# Altium project FinalCooling.PrjPcb
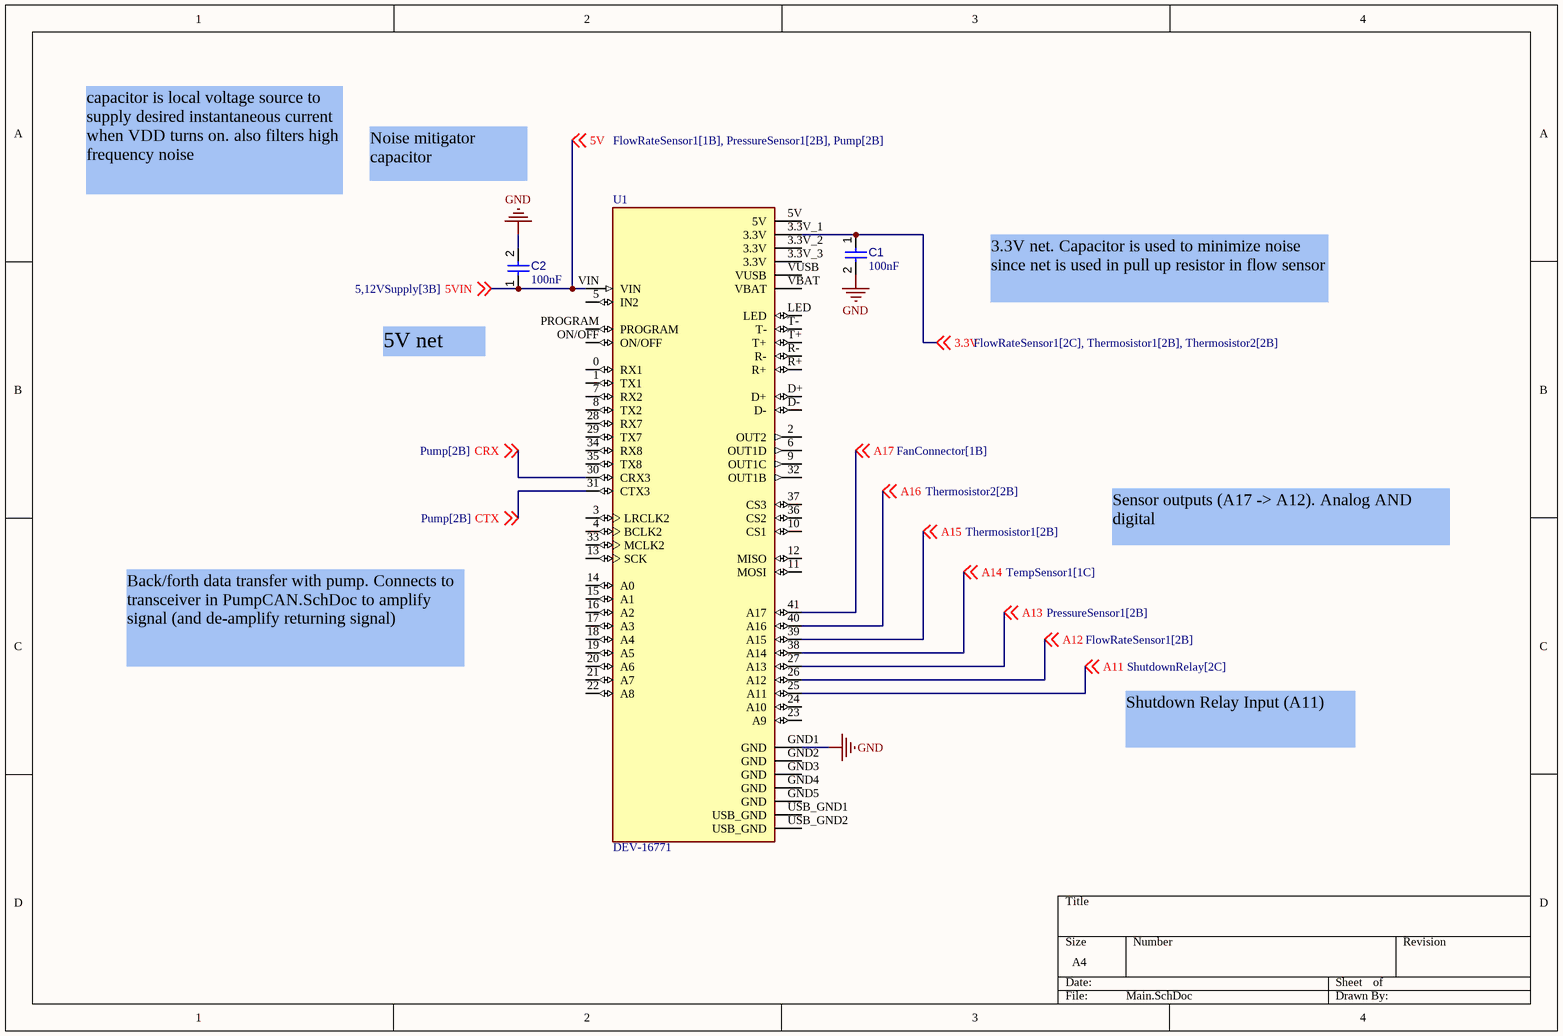
[diagram p0: Main.SchDoc]
10 sheets, 31 parts. Net scope: global (net labels, ports and power ports of the same name join across sheets).
Board file: PCB1.PcbDoc
Sheets:
  Main.SchDoc
  Thermosistor2.SchDoc
  FanConnector.SchDoc
  Pump.SchDoc
  TempSensor1.SchDoc
  Thermosistor1.SchDoc
  PressureSensor1.SchDoc
  FlowRateSensor1.SchDoc
  5,12VSupply.SchDoc
  16VPow.SchDoc

## Sheet Main.SchDoc
size A4; SheetNumber: 1; SheetTotal: 11

### Parts
C1  value 100nF  [CAPC1005X56X25LL10T15]  (hidden comment: Capacitor 0.1 uF +/- 5% 16 V 0402)
C2  value 100nF  [CAPC1005X56X25LL10T15]  (hidden comment: Capacitor 0.1 uF +/- 5% 16 V 0402)
U1  DEV-16771  [MODULE_DEV-16771]

### Nets
GND: C1.2 C2.2 U1.GND1(GND)
3.3V: C1.1 U1.3.3V_1(3.3V) ; off-sheet 3.3V
5V: C2.1 U1.VIN ; off-sheet 5V, off-sheet 5VIN  [also labelled 5VIN]
A11: U1.25(A11) ; off-sheet A11
A12: U1.26(A12) ; off-sheet A12
A13: U1.27(A13) ; off-sheet A13
A14: U1.38(A14) ; off-sheet A14
A15: U1.39(A15) ; off-sheet A15
A16: U1.40(A16) ; off-sheet A16
A17: U1.41(A17) ; off-sheet A17
CRX: U1.30(CRX3) ; off-sheet CRX
CTX: U1.31(CTX3) ; off-sheet CTX

Not connected (* = marked no-connect by the designer): U1 0(RX1) 1(TX1) 2(OUT2) 3(LRCLK2) 3.3V_2(3.3V) 3.3V_3(3.3V) 4(BCLK2) 5(IN2) 5V 6(OUT1D) 7(RX2) 8(TX2) 9(OUT1C) 10(CS1) 11(MOSI) 12(MISO) 13(SCK) 14(A0) 15(A1) 16(A2) 17(A3) 18(A4) 19(A5) 20(A6) 21(A7) 22(A8) 23(A9) 24(A10) 28(RX7) 29(TX7) 32(OUT1B) 33(MCLK2) 34(RX8) 35(TX8) 36(CS2) 37(CS3) D+ D- GND2(GND) GND3(GND) GND4(GND) GND5(GND) LED ON/OFF PROGRAM R+ R- T+ T- USB_GND1(USB_GND) USB_GND2(USB_GND) VBAT VUSB

### Notes on the sheet
- Noise mitigator capacitor
- capacitor is local voltage source to supply desired instantaneous current when VDD turns on. also filters high frequency noise
- 3.3V net. Capacitor is used to minimize noise since net is used in pull up resistor in flow sensor
- 5V net
- Sensor outputs (A17 -> A12). Analog AND digital
- Back/forth data transfer with pump. Connects to transceiver in PumpCAN.SchDoc to amplify signal (and de-amplify returning signal)
- Shutdown Relay Input (A11)

### Library data of the parts
C1 C2 = CMP-001-00001-6: Chip Capacitor, 0.1 uF, +/- 5%, 16 V, 0402 (1005 Metric); Capacitor Type: Ceramic; Voltage Rating: 16V; Max Operating Temperature: 125°C; Min Operating Temperature: -55°C; Case/Package: 0402; Mounting Technology: SM; Pins: 2; Tolerance: 5%; RoHS Compliant: True
U1 = CMP-031-00006-1: RT1062 Teensy 4.1 series ARM® Cortex®-M7 MPU Embedded Evaluation Board; MF: SparkFun Electronics; Case/Package: None; Source: DEV-16771.SchLib; SnapEDA_Link: https://www.snapeda.com/parts/DEV-16771/SparkFun+Electronics/view-part/?ref=snap; Component Type: Standard; Value: *; Design Item ID: DEV-16771; Check_prices: https://www.snapeda.com/parts/DEV-16771/SparkFun+Electronics/view-part/?ref=eda; MP: DEV-16771; Pins: 65

## Sheet Thermosistor2.SchDoc
size A4; SheetNumber: 3; SheetTotal: 11
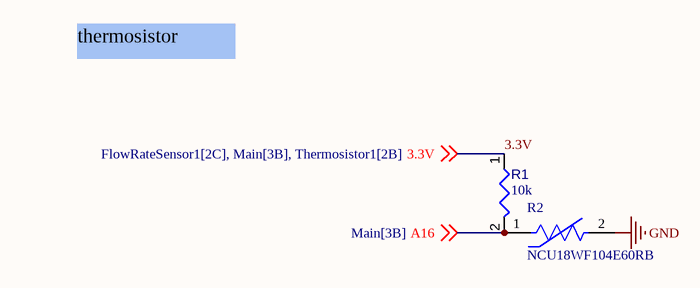
[diagram p1: Thermosistor2.SchDoc]

### Parts
R1  value 10k  [RESC0402(1005)_L]  (hidden comment: Resistor 10K  +/-1 % 0402 63 mW)
R2  NCU18WF104E60RB  [FP-NCU18-0_15-IPC_C]

### Nets
GND: R2.2
3.3V: R1.1 ; off-sheet 3.3V
A16: R1.2 R2.1 ; off-sheet A16

### Notes on the sheet
- thermosistor

### Library data of the parts
R1 = CMP-009-00149-3: Chip Resistor, 10 kOhms, +/-1 %, 63 mW, -55 to 125 degC, 0402; Power: 63mW; Tolerance: 1%; Min Operating Temperature: -55°C; Case/Package: 0402; Max Operating Temperature: 155°C; Pins: 2
R2 = CMP-06022-000229-2: THERMISTOR NTC

## Sheet FanConnector.SchDoc
size A4; SheetNumber: 4; SheetTotal: 11
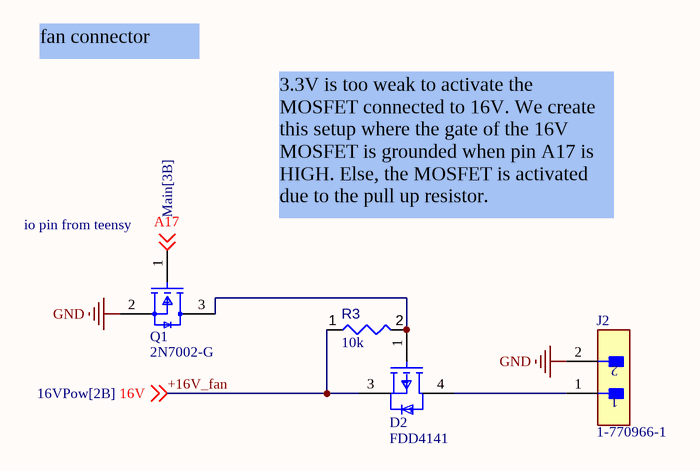
[diagram p2: FanConnector.SchDoc]

### Parts
D2  FDD4141  [FP-369AS-MFG]
J2  1-770966-1  [FP-1-770966-1-MFG]
Q1  2N7002-G  [FP-2N7002-G-IPC_C]
R3  value 10k  [RESC0402(1005)_L]  (hidden comment: Resistor 10K  +/-1 % 0402 63 mW)

### Nets
GND: J2.2 Q1.2(SOURCE)
+16V_fan: D2.3(S) R3.1 ; off-sheet 16V  [also labelled 16V]
A17: Q1.1(GATE) ; off-sheet A17
NetD2_1: D2.1(G) Q1.3(DRAIN) R3.2
NetD2_4: D2.4(D) J2.1

### Notes on the sheet
- fan connector
- (near Q1) io pin from teensy
- 3.3V is too weak to activate the MOSFET connected to 16V. We create this setup where the gate of the 16V MOSFET is grounded when pin A17 is HIGH. Else, the MOSFET is activated due to the pull up resistor.

### Library data of the parts
D2 = CMP-07173-000088-1: MOSFET P-CH 40V 10.8A DPAK; Manufacturer: ON Semiconductor; Gate Charge At Vgs: 36nC @ -10V; Transconductance: 38S; Drain To Source Breakdown Voltage: -40V; Reverse Recovery Time: 29ns; Pulse Drain Current: -100A; Reverse Recovery Charge: 26nC; Drain To Source Resistance: 10.1mΩ; Power Dissipation: 2.4W; Max Forward Diode Voltage: -1.2V; Turn Off Delay Time: 38ns; Number Of P Channels: 1; Gate To Source Voltage: 20V; Rthja Max: 52°C/W; Depletion Mode: False; Threshold Vgs Max: -3V; Threshold Vgs Min: -1V; Turn On Delay Time: 10ns; Max Junction Temp: +150°C; Input Capacitace At Vds: 2085pF @ -20V; Continuous Drain Current: -10.8A; Typ Forward Diode Voltage: -0.8V; Package: 369AS; Category: Diode; RoHS: TRUE; Device Class L2: Transistors; Octopart: https://octopart.com/fdd4141-on+semiconductor-84325802; Temperature: -55°C to +150°C; Drain To Source Voltage: -40V; Device Class L1: Discrete Semiconductors; Temperature Range Low: -55°C; Height: 2.517mm; ComponentLink2Description: Datasheet; Automotive: No; Number Of Channels: 1; Digikey Description: MOSFET P-CH 40V 10.8A DPAK; Lead Free: Yes; Manufacturer Part Number: FDD4141; Temperature Range High: +150°C; Footprint Url: https://www.onsemi.com/pub/Collateral/369AS.PDF; Device Class L3: MOSFETs; Mouser Description: MOSFET -40V P-Channel PowerTrench; ComponentLink2URL: https://www.onsemi.com/pub/Collateral/FDD4141-D.pdf
J2 = CMP-03369-000082-1: CONN HEADER R/A 2POS 4.14MM; Manufacturer: TE; Current Rating: 9.5A; Standoff Height: 0.63mm; Conn Gender: Male; Voltage Rating: 600V; Number Of Contacts: 2; Conn Orientation: Right Angle; Device Class L3: unset; Pitch: 4.14mm; Height: 7.9mm; Temperature Range High: +105°C; Octopart: https://octopart.com/1-770966-1-te+connectivity-46506767; Automotive: No; Digikey Description: CONN HEADER R/A 2POS 4.14MM; ComponentLink2URL: https://www.te.com/usa-en/product-1-770966-1.html?te_bu=Cor&te_type=other&te_campaign=oct_glo_cor-oct-global-oth-prtnr-fy19-oct-octo-buy-bom_sma-298_2&elqCampaignId=35216; Category: Conn; Lead Free: Yes; Mouser Description: Pin & Socket Connectors HEADER 2 POS R/A GOLD IN-LINE; ComponentLink2Description: Datasheet; Contact Material: Gold,Tin,Nickel; Device Class L1: Connectors; Number Of Rows: 1; Device Class L2: Headers and Wire Housings; Package: 1-770966-1; RoHS: TRUE; Manufacturer Part Number: 1-770966-1; Temperature: -55°C to +105°C; Temperature Range Low: -55°C
Q1 = CMP-06369-000003-1: MOSFET N-CH 60V 0.115A SOT23-3; Manufacturer: Microchip; Standoff Height: 0.01mm; Rthja Max: 203°C/W; Continuous Drain Current: 115mA; Depletion Mode: False; Typ Forward Diode Voltage: 1.2V; Number Of Channels: 1; Power Dissipation: 0.36W; Turn Off Delay Time: 20ns; Threshold Vgs Min: 1V; Threshold Vgs Max: 2.5V; Drain To Source Resistance: 7.5Ω; Input Capacitace At Vds: 50pF @ 25V; Reverse Recovery Time: 400ns; Pulse Drain Current: 800mA; Gate To Source Voltage: 30V; Manufacturer Part Number: 2N7002-G; Ambient Temperature Range Low: -55°C; Temperature Range Low: -55°C; ComponentLink2Description: Datasheet; Automotive: No; Temperature Range High: +150°C; Temperature: -55°C to +150°C; Ambient Temperature Range High: +150°C; ComponentLink2URL: http://ww1.microchip.com/downloads/en/DeviceDoc/2N7002-N-Channel-Enhancement-Mode-Vertical-DMOS-FET-Data-Sheet-20005797A.pdf; Octopart: https://octopart.com/2n7002-g-microchip-47153309; Mouser Description: Mosfet; N-channel Enhancement Mode; 60V; 7.5 OHM3 SOT-23T/R; Lead Free: Yes; Number Of N Channels: 1; Turn On Delay Time: 20ns; RoHS: TRUE; Digikey Description: MOSFET N-CH 60V 0.115A SOT23-3; Category: Trans; Ipc Land Pattern Name: SOT95P237X100-3; Height: 1.12mm; Device Class L2: Transistors; Drain To Source Breakdown Voltage: 60V; Device Class L1: Discrete Semiconductors; Drain To Source Voltage: 60V; Device Class L3: MOSFETs; Package: 2N7002-G
R3 = CMP-009-00149-3: as R1 on sheet Thermosistor2; Min Operating Temperature: -55°C; Case/Package: 0402; Max Operating Temperature: 155°C; Pins: 2

## Sheet Pump.SchDoc
size A4; SheetNumber: 5; SheetTotal: 11
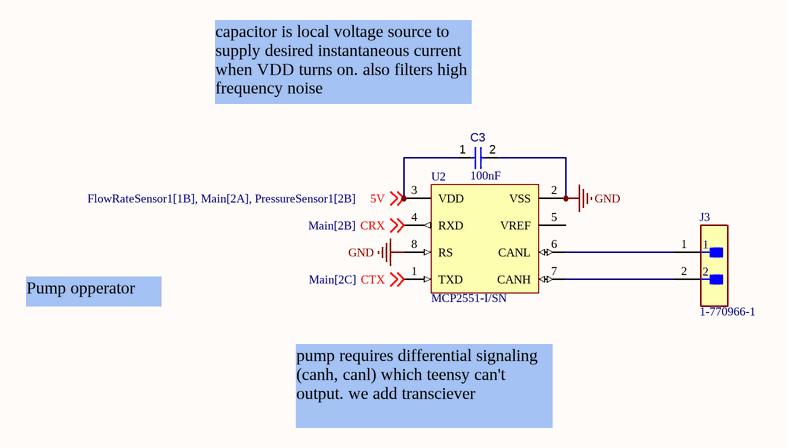
[diagram p3: Pump.SchDoc]

### Parts
C3  value 100nF  [CAPC1005X56X25LL10T15]  (hidden comment: Capacitor 0.1 uF +/- 5% 16 V 0402)
J3  1-770966-1  [FP-1-770966-1-MFG]
U2  MCP2551-I/SN  [MCHP-SN8_V]

### Nets
GND: C3.2 U2.2(VSS) U2.8(RS)
5V: C3.1 U2.3(VDD) ; off-sheet 5V
CRX: U2.4(RXD) ; off-sheet CRX
CTX: U2.1(TXD) ; off-sheet CTX
NetJ3_1: J3.1 U2.6(CANL)
NetJ3_2: J3.2 U2.7(CANH)

Not connected (* = marked no-connect by the designer): U2 5(VREF)

### Notes on the sheet
- capacitor is local voltage source to supply desired instantaneous current when VDD turns on. also filters high frequency noise
- Pump opperator
- pump requires differential signaling (canh, canl) which teensy can't output. we add transciever

### Library data of the parts
C3 = CMP-001-00001-6: as C1 on sheet Main; Max Operating Temperature: 125°C; Min Operating Temperature: -55°C; Case/Package: 0402; Mounting Technology: SM; Pins: 2; Tolerance: 5%; RoHS Compliant: True
J3 = CMP-03369-000082-1: as J2 on sheet FanConnector; Device Class L3: unset; Pitch: 4.14mm; Height: 7.9mm; Temperature Range High: +105°C; Octopart: https://octopart.com/1-770966-1-te+connectivity-46506767; Automotive: No; Digikey Description: CONN HEADER R/A 2POS 4.14MM; ComponentLink2URL: https://www.te.com/usa-en/product-1-770966-1.html?te_bu=Cor&te_type=other&te_campaign=oct_glo_cor-oct-global-oth-prtnr-fy19-oct-octo-buy-bom_sma-298_2&elqCampaignId=35216; Category: Conn; Lead Free: Yes; Mouser Description: Pin & Socket Connectors HEADER 2 POS R/A GOLD IN-LINE; ComponentLink2Description: Datasheet; Contact Material: Gold,Tin,Nickel; Device Class L1: Connectors; Number Of Rows: 1; Device Class L2: Headers and Wire Housings; Package: 1-770966-1; RoHS: TRUE; Manufacturer Part Number: 1-770966-1; Temperature: -55°C to +105°C; Temperature Range Low: -55°C
U2 = CMP-0186-00138-3: High-Speed CAN Transceiver, / 1 Mb/s, 4.5 to 5.5 V, 8-Pin SOIC (SN), Industrial Temperature, RoHS, Tube; Manufacturer: Microchip; RoHSCompliant: true; PackageReference: SN8; ComponentLink1URL: http://www.microchip.com/; DatasheetVersion: Rev. F, 07/2010; ComponentLink2Description: Datasheet; ComponentLink2URL: http://ww1.microchip.com/downloads/en/DeviceDoc/21667f.pdf; ComponentLink3Description: Package Specification; PackageDescription: 8-Pin Small Outline Integrated Circuit, Body 4.9 x 3.9 mm, Pitch 1.27 mm; ComponentLink1Description: Manufacturer URL; Mounting Technology: Surface Mount; ComponentLink3URL: http://www.microchip.com/stellent/groups/techpub_sg/documents/packagingspec/en012702.pdf

## Sheet TempSensor1.SchDoc
size A4; SheetNumber: 6; SheetTotal: 11
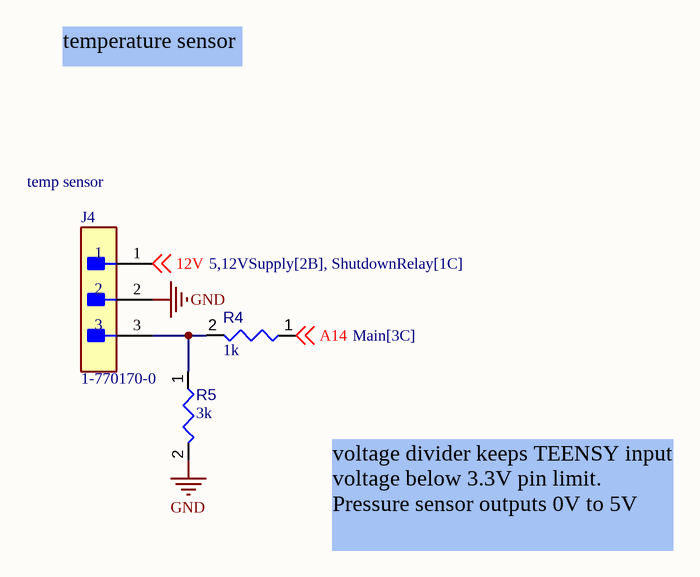
[diagram p4: TempSensor1.SchDoc]

### Parts
J4  1-770170-0  [FP-1-770170-0-MFG]
R4  value 1k  [RESC0402(1005)_L]  (hidden comment: 1KR2J)
R5  value 3k  [RESC0402(1005)_L]  (hidden comment: 3KR2F)

### Nets
GND: J4.2 R5.2
12V: J4.1 ; off-sheet 12V
A14: R4.1 ; off-sheet A14
NetJ4_3: J4.3 R4.2 R5.1

### Notes on the sheet
- temperature sensor
- temp sensor
- voltage divider keeps TEENSY input voltage below 3.3V pin limit. Pressure sensor outputs 0V to 5V

### Library data of the parts
J4 = CMP-03369-000023-1: CONN HEADER VERT 3POS 4.14MM; Manufacturer: TE Connectivity; Voltage Rating: 600V; Standoff Height: 0.63mm; Conn Gender: Male; Number Of Contacts: 3; Conn Orientation: Vertical; Current Rating: 9.5A; Temperature Range Low: -55°C; Device Class L3: unset; Temperature Range High: +105°C; Octopart: https://octopart.com/1-770170-0-te+connectivity-46505214; Mouser Description: Pin & Socket Connectors HEADER 3 POS TIN IN LINE; Package: 1-770170-0; Pitch: 4.14mm; ComponentLink2Description: Datasheet; Category: Conn; Number Of Rows: 1; Device Class L1: Connectors; Height: 14.51mm; Contact Material: Gold,Nickel; Digikey Description: CONN HEADER VERT 3POS 4.14MM; ComponentLink2URL: https://www.te.com/commerce/DocumentDelivery/DDEController?Action=showdoc&DocId=Customer+Drawing%7F770170%7FM2%7Fpdf%7FEnglish%7FENG_CD_770170_M2.pdf%7F1-770170-0; Automotive: No; Temperature: -55°C to +105°C; Manufacturer Part Number: 1-770170-0; Lead Free: Yes; Device Class L2: Headers and Wire Housings; RoHS: TRUE
R4 = CMP-009-00075-2: 1K 0.063W 5% 0402 (1005 Metric)  SMD; Power: 63mW; Pins: 2; Mounting Technology: SMT; Case/Package: 0402; Tolerance: 5%
R5 = CMP-009-00099-2: 3K 0.063W 1% 0402 (1005 Metric)  SMD; Power: 63mW; Case/Package: 0402; Tolerance: 1%; Mounting Technology: SMT; Pins: 2

## Sheet Thermosistor1.SchDoc
size A4; SheetNumber: 7; SheetTotal: 11
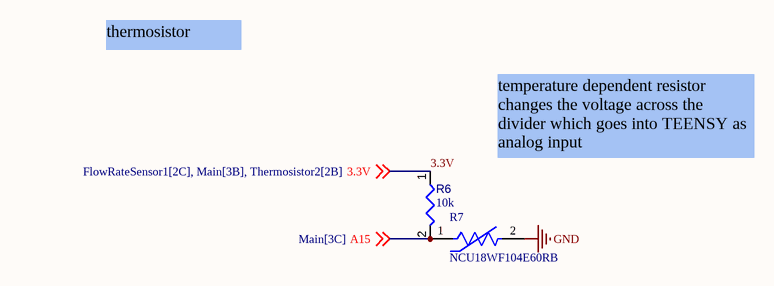
[diagram p5: Thermosistor1.SchDoc]

### Parts
R6  value 10k  [RESC0402(1005)_L]  (hidden comment: Resistor 10K  +/-1 % 0402 63 mW)
R7  NCU18WF104E60RB  [FP-NCU18-0_15-IPC_C]

### Nets
GND: R7.2
3.3V: R6.1 ; off-sheet 3.3V
A15: R6.2 R7.1 ; off-sheet A15

### Notes on the sheet
- thermosistor
- temperature dependent resistor changes the voltage across the divider which goes into TEENSY as analog input

### Library data of the parts
R6 = CMP-009-00149-3: as R1 on sheet Thermosistor2; Min Operating Temperature: -55°C; Case/Package: 0402; Max Operating Temperature: 155°C; Pins: 2
R7 = CMP-06022-000229-2: THERMISTOR NTC

## Sheet PressureSensor1.SchDoc
size A4; SheetNumber: 8; SheetTotal: 11
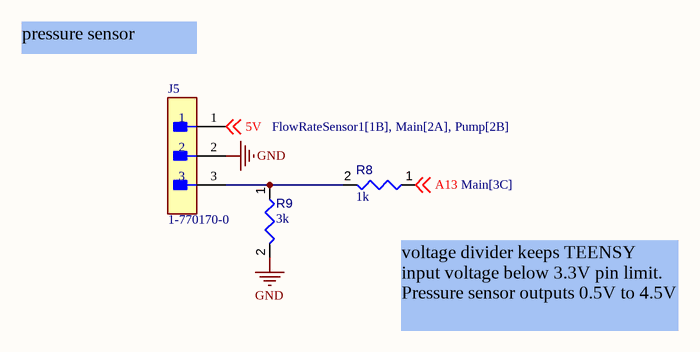
[diagram p6: PressureSensor1.SchDoc]

### Parts
J5  1-770170-0  [FP-1-770170-0-MFG]
R8  value 1k  [RESC0402(1005)_L]  (hidden comment: 1KR2J)
R9  value 3k  [RESC0402(1005)_L]  (hidden comment: 3KR2F)

### Nets
GND: J5.2 R9.2
5V: J5.1 ; off-sheet 5V
A13: R8.1 ; off-sheet A13
NetJ5_3: J5.3 R8.2 R9.1

### Notes on the sheet
- pressure sensor
- (near R8) voltage divider keeps TEENSY input voltage below 3.3V pin limit. Pressure sensor outputs 0.5V to 4.5V

### Library data of the parts
J5 = CMP-03369-000023-1: as J4 on sheet TempSensor1; Temperature Range Low: -55°C; Device Class L3: unset; Temperature Range High: +105°C; Octopart: https://octopart.com/1-770170-0-te+connectivity-46505214; Mouser Description: Pin & Socket Connectors HEADER 3 POS TIN IN LINE; Package: 1-770170-0; Pitch: 4.14mm; ComponentLink2Description: Datasheet; Category: Conn; Number Of Rows: 1; Device Class L1: Connectors; Height: 14.51mm; Contact Material: Gold,Nickel; Digikey Description: CONN HEADER VERT 3POS 4.14MM; ComponentLink2URL: https://www.te.com/commerce/DocumentDelivery/DDEController?Action=showdoc&DocId=Customer+Drawing%7F770170%7FM2%7Fpdf%7FEnglish%7FENG_CD_770170_M2.pdf%7F1-770170-0; Automotive: No; Temperature: -55°C to +105°C; Manufacturer Part Number: 1-770170-0; Lead Free: Yes; Device Class L2: Headers and Wire Housings; RoHS: TRUE
R8 = CMP-009-00075-2: as R4 on sheet TempSensor1; Pins: 2; Mounting Technology: SMT; Case/Package: 0402; Tolerance: 5%
R9 = CMP-009-00099-2: as R5 on sheet TempSensor1; Case/Package: 0402; Tolerance: 1%; Mounting Technology: SMT; Pins: 2

## Sheet FlowRateSensor1.SchDoc
size A4; SheetNumber: 9; SheetTotal: 11
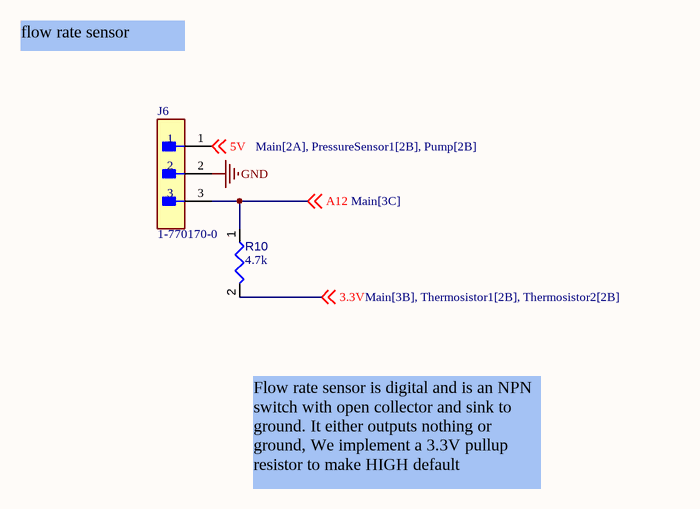
[diagram p7: FlowRateSensor1.SchDoc]

### Parts
J6  1-770170-0  [FP-1-770170-0-MFG]
R10  value 4.7k  [RESC1005X40X25ML05T05]  (hidden comment: Resistor 4k7 +/-1% 0402 100 mW)

### Nets
GND: J6.2
3.3V: R10.2 ; off-sheet 3.3V
5V: J6.1 ; off-sheet 5V
A12: J6.3 R10.1 ; off-sheet A12

### Notes on the sheet
- flow rate sensor
- Flow rate sensor is digital and is an NPN switch with open collector and sink to ground. It either outputs nothing or ground, We implement a 3.3V pullup resistor to make HIGH default

### Library data of the parts
J6 = CMP-03369-000023-1: as J4 on sheet TempSensor1; Temperature Range Low: -55°C; Device Class L3: unset; Temperature Range High: +105°C; Octopart: https://octopart.com/1-770170-0-te+connectivity-46505214; Mouser Description: Pin & Socket Connectors HEADER 3 POS TIN IN LINE; Package: 1-770170-0; Pitch: 4.14mm; ComponentLink2Description: Datasheet; Category: Conn; Number Of Rows: 1; Device Class L1: Connectors; Height: 14.51mm; Contact Material: Gold,Nickel; Digikey Description: CONN HEADER VERT 3POS 4.14MM; ComponentLink2URL: https://www.te.com/commerce/DocumentDelivery/DDEController?Action=showdoc&DocId=Customer+Drawing%7F770170%7FM2%7Fpdf%7FEnglish%7FENG_CD_770170_M2.pdf%7F1-770170-0; Automotive: No; Temperature: -55°C to +105°C; Manufacturer Part Number: 1-770170-0; Lead Free: Yes; Device Class L2: Headers and Wire Housings; RoHS: TRUE
R10 = CMP-009-00030-5: Chip Resistor, 4.7 KOhm, +/- 1%, 0.1 W, -55 to 155 degC, 0402 (1005 Metric); Power: 100mW; Voltage Rating: 50V; Mounting Technology: SM; RoHS Compliant: True; Tolerance: 1%; Min Operating Temperature: -55°C; Max Operating Temperature: 155°C; Case/Package: 0402; Pins: 2

## Sheet 5,12VSupply.SchDoc
size A4; SheetNumber: 10; SheetTotal: 11
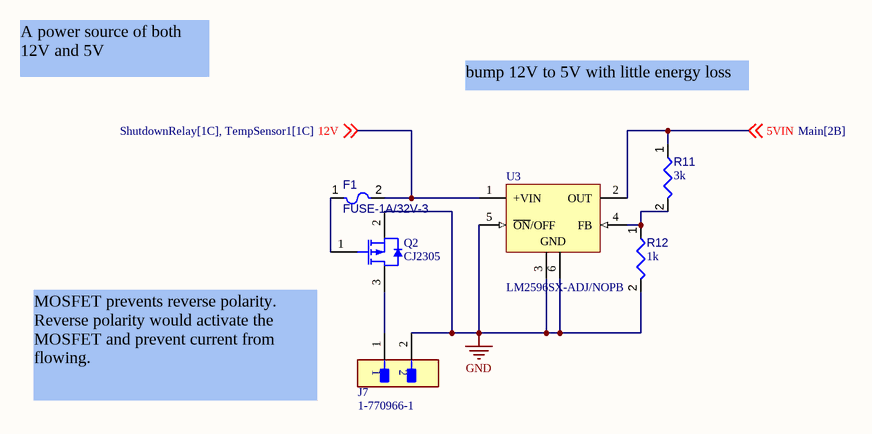
[diagram p8: 5,12VSupply.SchDoc]

### Parts
F1  FUSE-1A/32V-3  [LFUS-467_V]
J7  1-770966-1  [FP-1-770966-1-MFG]
Q2  CJ2305  [JSCJ-SOT23-3_V]
R11  value 3k  [RESC0402(1005)_L]  (hidden comment: 3KR2F)
R12  value 1k  [RESC0402(1005)_L]  (hidden comment: 1KR2J)
U3  LM2596SX-ADJ/NOPB  [KTT0005B_L]

### Nets
GND: J7.2 Q2.2(SOURCE) R12.2 U3.3(GND) U3.5(~{ON}/OFF) U3.6(GND)
5VIN: R11.1 U3.2(OUT) ; off-sheet 5VIN  [project net 5V]
12V: F1.2 U3.1(+VIN) ; off-sheet 12V
NetF1_1: F1.1 Q2.1(GATE)
NetJ7_1: J7.1 Q2.3(DRAIN)
NetR11_2: R11.2 R12.1 U3.4(FB)

### Notes on the sheet
- A power source of both 12V and 5V
- bump 12V to 5V with little energy loss
- MOSFET prevents reverse polarity. Reverse polarity would activate the MOSFET and prevent current from flowing.

### Library data of the parts
F1 = CMP-005-00012-2: Fast Acting Fuse, 1 A, 32 V, -55 to 90 degC, 2-Pin SMD, RoHS, Tape and Reel; Current Rating: 1A; Case/Package: LFUS-467; Pins: 2
J7 = CMP-03369-000082-1: as J2 on sheet FanConnector; Device Class L3: unset; Pitch: 4.14mm; Height: 7.9mm; Temperature Range High: +105°C; Octopart: https://octopart.com/1-770966-1-te+connectivity-46506767; Automotive: No; Digikey Description: CONN HEADER R/A 2POS 4.14MM; ComponentLink2URL: https://www.te.com/usa-en/product-1-770966-1.html?te_bu=Cor&te_type=other&te_campaign=oct_glo_cor-oct-global-oth-prtnr-fy19-oct-octo-buy-bom_sma-298_2&elqCampaignId=35216; Category: Conn; Lead Free: Yes; Mouser Description: Pin & Socket Connectors HEADER 2 POS R/A GOLD IN-LINE; ComponentLink2Description: Datasheet; Contact Material: Gold,Tin,Nickel; Device Class L1: Connectors; Number Of Rows: 1; Device Class L2: Headers and Wire Housings; Package: 1-770966-1; RoHS: TRUE; Manufacturer Part Number: 1-770966-1; Temperature: -55°C to +105°C; Temperature Range Low: -55°C
Q2 = CMP-013-00015-3: P-Channel Plastic Encapsulate MOSFET, 12 V, 4.1 A, 3-Pin SOT23, Tape and Reel; Manufacturer: Jiangsu Changjiang Electronics Technology; Package Version: Rev. E, 09/2009; Datasheet URL: http://www.cj-elec.com/gallery/txUpfile/5140ba9ed47d18467ea4bddc055cd747.pdf; Case/Package: SOT23-3; Mounting Technology: SM; RoHS Compliant: Unknown; Datasheet Version: Rev. F, 04/2015; Package Description: 3-Pin Small Outline Transistor, Body 2.9 x 1.3 mm, Pitch 0.95 mm; Package Reference: SOT23-3
R11 = CMP-009-00099-2: as R5 on sheet TempSensor1; Case/Package: 0402; Tolerance: 1%; Mounting Technology: SMT; Pins: 2
R12 = CMP-009-00075-2: as R4 on sheet TempSensor1; Pins: 2; Mounting Technology: SMT; Case/Package: 0402; Tolerance: 5%
U3 = CMP-2000-06545-1: Simple Switcher(R) Power Converter 150 kHz Step-Down Voltage Regulator, 3 A, 4.5 to 40 V, -40 to 125 degC, 5-Pin TO-263 (KTT), Green (RoHS & no Sb/Br), Tape and Reel; PartNumber: LM2596; Manufacturer: Texas Instruments; Package Version: 4200577-4/G, 01/2013; Primary Input Voltage: 40V; No. of Outputs: 1; No. of Pins: 5; SVHC: NoSVHC(19-Dec-2012); Output Voltage: 37V; Output Current: 3A; Datasheet Version: Rev. C, 04/2013; Package Reference: KTT5; MSL: MSL3-168hours; Number of Outputs: 1; Operating Temperature Min: -40°C; Operating Temperature Range: -40°Cto+125°C; Manufacturer URL: http://www.ti.com/; Package URL: http://www.ti.com/litv/pdf/mpsf007e; Voltage Regulator Case Style: TO-263; Operating Temperature Max: 125°C; Package Description: 5-Pin Plastic Flange Mount, Body 10.16 x 8.925 mm, Pitch 1.7 mm; Datasheet URL: http://www.ti.com/lit/ds/symlink/lm2596.pdf; Mounting Technology: SurfaceMount

## Sheet 16VPow.SchDoc
size A4; SheetNumber: 11; SheetTotal: 11
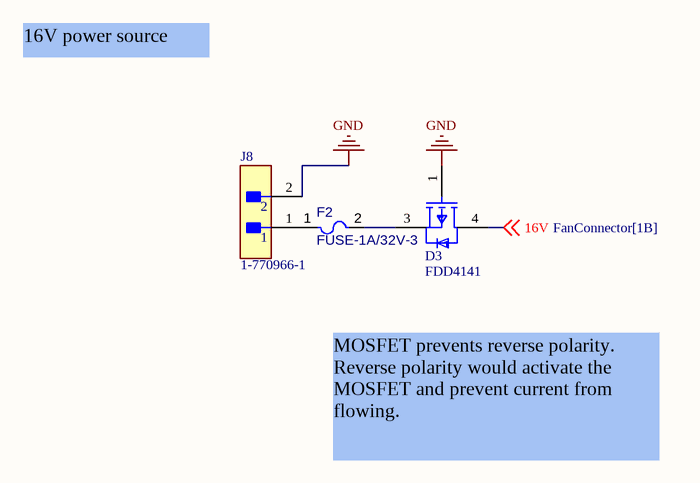
[diagram p9: 16VPow.SchDoc]

### Parts
D3  FDD4141  [FP-369AS-MFG]
F2  FUSE-1A/32V-3  [LFUS-467_V]
J8  1-770966-1  [FP-1-770966-1-MFG]

### Nets
GND: D3.1(G) J8.2
16V: D3.4(D) ; off-sheet 16V  [project net +16V_fan]
NetD3_3: D3.3(S) F2.2
NetF2_1: F2.1 J8.1

### Notes on the sheet
- 16V power source
- MOSFET prevents reverse polarity. Reverse polarity would activate the MOSFET and prevent current from flowing.

### Library data of the parts
D3 = CMP-07173-000088-1: as D2 on sheet FanConnector; Package: 369AS; Category: Diode; RoHS: TRUE; Device Class L2: Transistors; Octopart: https://octopart.com/fdd4141-on+semiconductor-84325802; Temperature: -55°C to +150°C; Drain To Source Voltage: -40V; Device Class L1: Discrete Semiconductors; Temperature Range Low: -55°C; Height: 2.517mm; ComponentLink2Description: Datasheet; Automotive: No; Number Of Channels: 1; Digikey Description: MOSFET P-CH 40V 10.8A DPAK; Lead Free: Yes; Manufacturer Part Number: FDD4141; Temperature Range High: +150°C; Footprint Url: https://www.onsemi.com/pub/Collateral/369AS.PDF; Device Class L3: MOSFETs; Mouser Description: MOSFET -40V P-Channel PowerTrench; ComponentLink2URL: https://www.onsemi.com/pub/Collateral/FDD4141-D.pdf
F2 = CMP-005-00012-2: as F1 on sheet 5,12VSupply; Case/Package: LFUS-467; Pins: 2
J8 = CMP-03369-000082-1: as J2 on sheet FanConnector; Device Class L3: unset; Pitch: 4.14mm; Height: 7.9mm; Temperature Range High: +105°C; Octopart: https://octopart.com/1-770966-1-te+connectivity-46506767; Automotive: No; Digikey Description: CONN HEADER R/A 2POS 4.14MM; ComponentLink2URL: https://www.te.com/usa-en/product-1-770966-1.html?te_bu=Cor&te_type=other&te_campaign=oct_glo_cor-oct-global-oth-prtnr-fy19-oct-octo-buy-bom_sma-298_2&elqCampaignId=35216; Category: Conn; Lead Free: Yes; Mouser Description: Pin & Socket Connectors HEADER 2 POS R/A GOLD IN-LINE; ComponentLink2Description: Datasheet; Contact Material: Gold,Tin,Nickel; Device Class L1: Connectors; Number Of Rows: 1; Device Class L2: Headers and Wire Housings; Package: 1-770966-1; RoHS: TRUE; Manufacturer Part Number: 1-770966-1; Temperature: -55°C to +105°C; Temperature Range Low: -55°C

## Nets that join several sheets
GND: Main (C1.2 C2.2 U1.GND1), Thermosistor2 (R2.2), FanConnector (J2.2 Q1.2), Pump (C3.2 U2.2 U2.8), TempSensor1 (J4.2 R5.2), Thermosistor1 (R7.2), PressureSensor1 (J5.2 R9.2), FlowRateSensor1 (J6.2), 5,12VSupply (6 pins), 16VPow (D3.1 J8.2)
3.3V: Main (C1.1 U1.3.3V_1), Thermosistor2 (R1.1), Thermosistor1 (R6.1), FlowRateSensor1 (R10.2)
5V: Main (C2.1 U1.VIN), Pump (C3.1 U2.3), PressureSensor1 (J5.1), FlowRateSensor1 (J6.1), 5,12VSupply (R11.1 U3.2)
12V: TempSensor1 (J4.1), 5,12VSupply (F1.2 U3.1)
+16V_fan: FanConnector (D2.3 R3.1), 16VPow (D3.4)
A12: Main (U1.26), FlowRateSensor1 (J6.3 R10.1)
A13: Main (U1.27), PressureSensor1 (R8.1)
A14: Main (U1.38), TempSensor1 (R4.1)
A15: Main (U1.39), Thermosistor1 (R6.2 R7.1)
A16: Main (U1.40), Thermosistor2 (R1.2 R2.1)
A17: Main (U1.41), FanConnector (Q1.1)
CRX: Main (U1.30), Pump (U2.4)
CTX: Main (U1.31), Pump (U2.1)